# EAGLE design Puck (EAGLE 7.3.0)
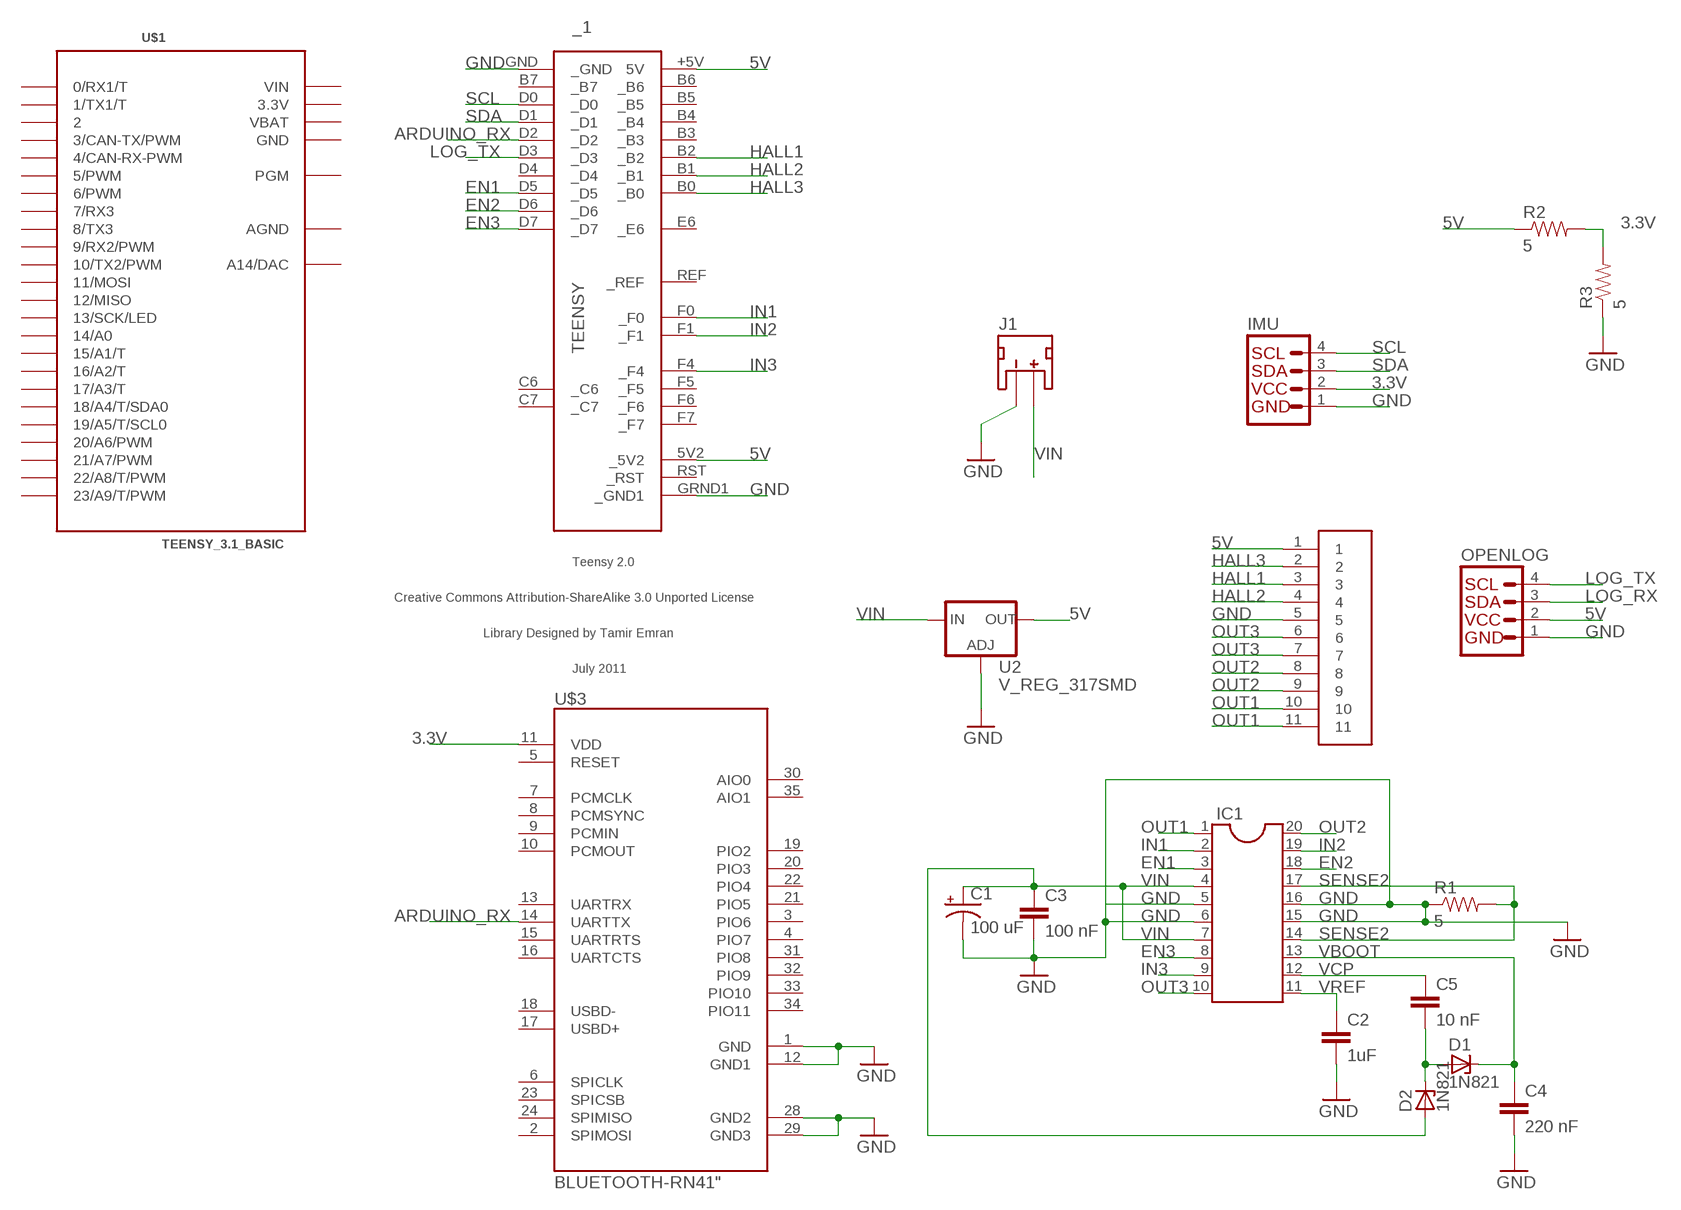
[diagram p0: schematic, sheet 1]

## Parts
_1  TEENSY  [TEENSY]
C1  100 uF  100UF-25V-20%(PTH)  [CPOL-RADIAL-100UF-25V]
C2  1uF  0.1UF-50V-20%(PTH)KIT-EZ  [CAP-PTH-SMALL-KIT]
C3  100 nF  0.1UF-50V-20%(PTH)KIT-EZ  [CAP-PTH-SMALL-KIT]
C4  220 nF  0.1UF-50V-20%(PTH)KIT-EZ  [CAP-PTH-SMALL-KIT]
C5  10 nF  0.1UF-50V-20%(PTH)KIT-EZ  [CAP-PTH-SMALL-KIT]
D1  1N821  [DO35Z10]
D2  1N821  [DO35Z10]
IC1  DIL20S  [SOCKET-20]
IMU  I2C_STANDARD  [1X04]
J1  JST_2MM_MALE  [JST-2-SMD]
MOLEX_MOTOR1  DEV  [52089FFCPACKAGE]
OPENLOG  I2C_STANDARD  [1X04]
R1  5  RESISTORAXIAL-0.3  [AXIAL-0.3]
R2  5  RESISTORAXIAL-0.3  [AXIAL-0.3]
R3  5  RESISTORAXIAL-0.3  [AXIAL-0.3]
U2  V_REG_317SMD  [SOT223]
U$1  TEENSY_3.1_BASIC  [TEENSY_3.1_BASIC]
U$3  BLUETOOTH-RN41"  [RN41]

## Nets
3.3V: IMU.2 R2.P$2 R3.P$2 U$3.11(VDD)
5V: _1.5V2(_5V2) _1.+5V(5V) MOLEX_MOTOR1.1 OPENLOG.2 R2.P$1 U2.2(OUT)
ARDUINO_RX: _1.D2(_D2) U$3.14(UARTTX)
EN1: _1.D5(_D5) IC1.3
EN2: _1.D6(_D6) IC1.18
EN3: _1.D7(_D7) IC1.8
GND [GND]: _1.GND(_GND) _1.GRND1(_GND1) C1.2(-) C2.2 C3.2 C4.2 IC1.5 IC1.6 IC1.15 IC1.16 IMU.1 J1.1(-) MOLEX_MOTOR1.5 OPENLOG.1 R1.P$1 R3.P$1 U2.1(ADJ) U$3.1(GND) U$3.12(GND1) U$3.28(GND2) U$3.29(GND3)
HALL1: _1.B2(_B2) MOLEX_MOTOR1.3
HALL2: _1.B1(_B1) MOLEX_MOTOR1.4
HALL3: _1.B0(_B0) MOLEX_MOTOR1.2
IN1: _1.F0(_F0) IC1.2
IN2: _1.F1(_F1) IC1.19
IN3: _1.F4(_F4) IC1.9
LOG_RX: OPENLOG.3
LOG_TX: _1.D3(_D3) OPENLOG.4
N$3: C5.2 D1.A D2.C
OUT1 [Power]: IC1.1 MOLEX_MOTOR1.10 MOLEX_MOTOR1.11
OUT2 [Power]: IC1.20 MOLEX_MOTOR1.8 MOLEX_MOTOR1.9
OUT3 [Power]: IC1.10 MOLEX_MOTOR1.6 MOLEX_MOTOR1.7
SCL: _1.D0(_D0) IMU.4
SDA: _1.D1(_D1) IMU.3
SENSE2: IC1.14 IC1.17 R1.P$2
VBOOT: C4.1 D1.C IC1.13
VCP: C5.1 IC1.12
VIN [Power]: C1.1(+) C3.1 D2.A IC1.4 IC1.7 J1.2(+) U2.3(IN)
VREF: C2.1 IC1.11
Unconnected: _1.B3(_B3) _1.B4(_B4) _1.B5(_B5) _1.B6(_B6) _1.B7(_B7) _1.C6(_C6) _1.C7(_C7) _1.D4(_D4) _1.E6(_E6) _1.F5(_F5) _1.F6(_F6) _1.F7(_F7) _1.REF(_REF) _1.RST(_RST) J1.NC1(PAD1) J1.NC2(PAD2) U$1.0(0/RX1/T) U$1.1(1/TX1/T) U$1.2 U$1.3(3/CAN-TX/PWM) U$1.4(4/CAN-RX-PWM) U$1.5(5/PWM) U$1.6(6/PWM) U$1.7(7/RX3) U$1.8(8/TX3) U$1.9(9/RX2/PWM) U$1.10(10/TX2/PWM) U$1.11(11/MOSI) U$1.12(12/MISO) U$1.13(13/SCK/LED) U$1.14/A0 U$1.15/A1(15/A1/T) U$1.16/A2(16/A2/T) U$1.17/A3(17/A3/T) U$1.18/A4(18/A4/T/SDA0) U$1.19/A5(19/A5/T/SCL0) U$1.20/A6(20/A6/PWM) U$1.21/A7(21/A7/PWM) U$1.22/A8(22/A8/T/PWM) U$1.23/A9(23/A9/T/PWM) U$1.A14(A14/DAC) U$1.PGM U$3.2(SPIMOSI) U$3.3(PIO6) U$3.4(PIO7) U$3.5(RESET) U$3.6(SPICLK) U$3.7(PCMCLK) U$3.8(PCMSYNC) U$3.9(PCMIN) U$3.10(PCMOUT) U$3.13(UARTRX) U$3.15(UARTRTS) U$3.16(UARTCTS) U$3.17(USBD+) U$3.18(USBD-) U$3.19(PIO2) U$3.20(PIO3) U$3.21(PIO5) U$3.22(PIO4) U$3.23(SPICSB) U$3.24(SPIMISO) U$3.30(AIO0) U$3.31(PIO8) U$3.32(PIO9) U$3.33(PIO10) U$3.34(PIO11) U$3.35(AIO1)

## Power pins joined to a net without a drawn wire
3.3V: U$1.3.3V U$1.3.3V1(3.3V)
AGND: U$1.AGND
GND: U$1.GND U$1.GND1(GND)
VBAT: U$1.VBAT
VIN: U$1.VIN

## Library data of the parts
_1 = teensy:TEENSY: Teensy 2.0 Original Design by Clint Fisher Modified Design by Tamir Emran Licensed Under Creative Commons Attribution-ShareAlike 3.0 Unported (CC BY-SA 3.0)
C1 = SparkFun-Capacitors:100UF-25V-20%(PTH): CAP-08439; PROD_ID: CAP-08439
C2-C5 = SparkFun-Capacitors:0.1UF-50V-20%(PTH): CAP-08370; PROD_ID: CAP-08370
D1 D2 = diode:1N821: Reference DIODE temperature compensated, 6,2 V
IC1 = ic-package:DIL20: Dual In Line / Socket
IMU OPENLOG = SparkFun-Connectors:I2C_STANDARD: SparkFun has standardized on a pinout for all I2C based sensor breakouts. This pinout allows I2C boards to be plugged directly into the headers on Arduino Uno compatible boards, and to be daisy chained easily.; MPN: BIM-AKT-Y1X-0.4M-RS4.21T/S561; OC_NEWARK: 31Y7236
J1 = SparkFun-Connectors:JST_2MM_MALE: Mates to single-cell LiPo batteries. CONN-08352; OC_NEWARK: unknown; PROD_ID: CONN-08352
MOLEX_MOTOR1 = Molex:DEV
R1-R3 = SparkFun-Passives:RESISTOR: Resistor Basic schematic elements and footprints for 0603, 1206, and PTH resistors.
U2 = SparkFun-PowerIC:V_REG_317: Voltage Regulator Standard LM317 adjustable voltage regulator. AOI (Adjust Output Input). Google 'LM317 Calculator' for easy to use app to get the two resistor values needed. 240/720 for 5V output. 240/390 for 3.3V output. Spark Fun Electronics SKU : COM-00527
U$1 = Teensy_3_Series_Board_v1.0:TEENSY_3.1_BASIC: Footprint for Teensy 3.1 board using all pin connections on the outer perimeter
U$3 = SparkFun-RF:BLUETOOTH-RN41: Bluetooth SMD module; OC_NEWARK: unknown

## Net classes
0 default: width 0.508 mm, drill 0.762 mm, clearance 0.254 mm
1 Power: width 0.813 mm, drill 1.016 mm, clearance 0.254 mm
2 GND: width 0.813 mm, drill 1.016 mm, clearance 0.254 mm

## Board
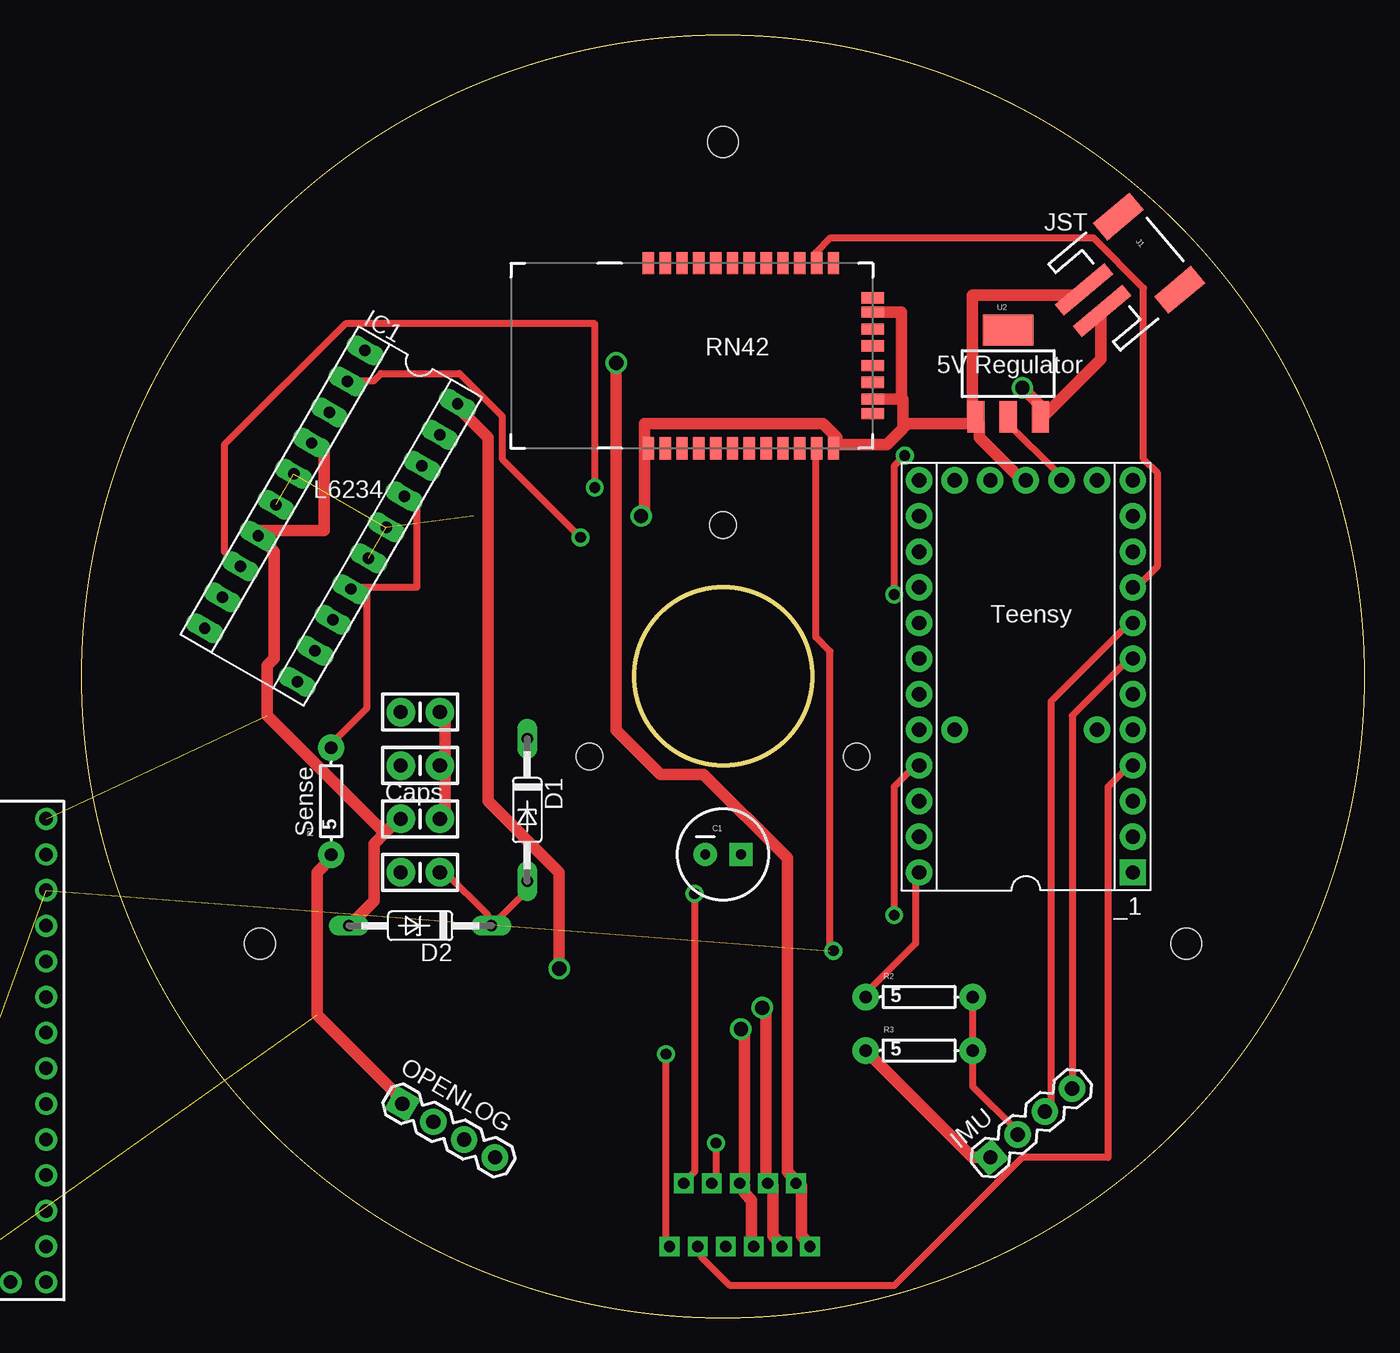
[diagram p1: board, top side]
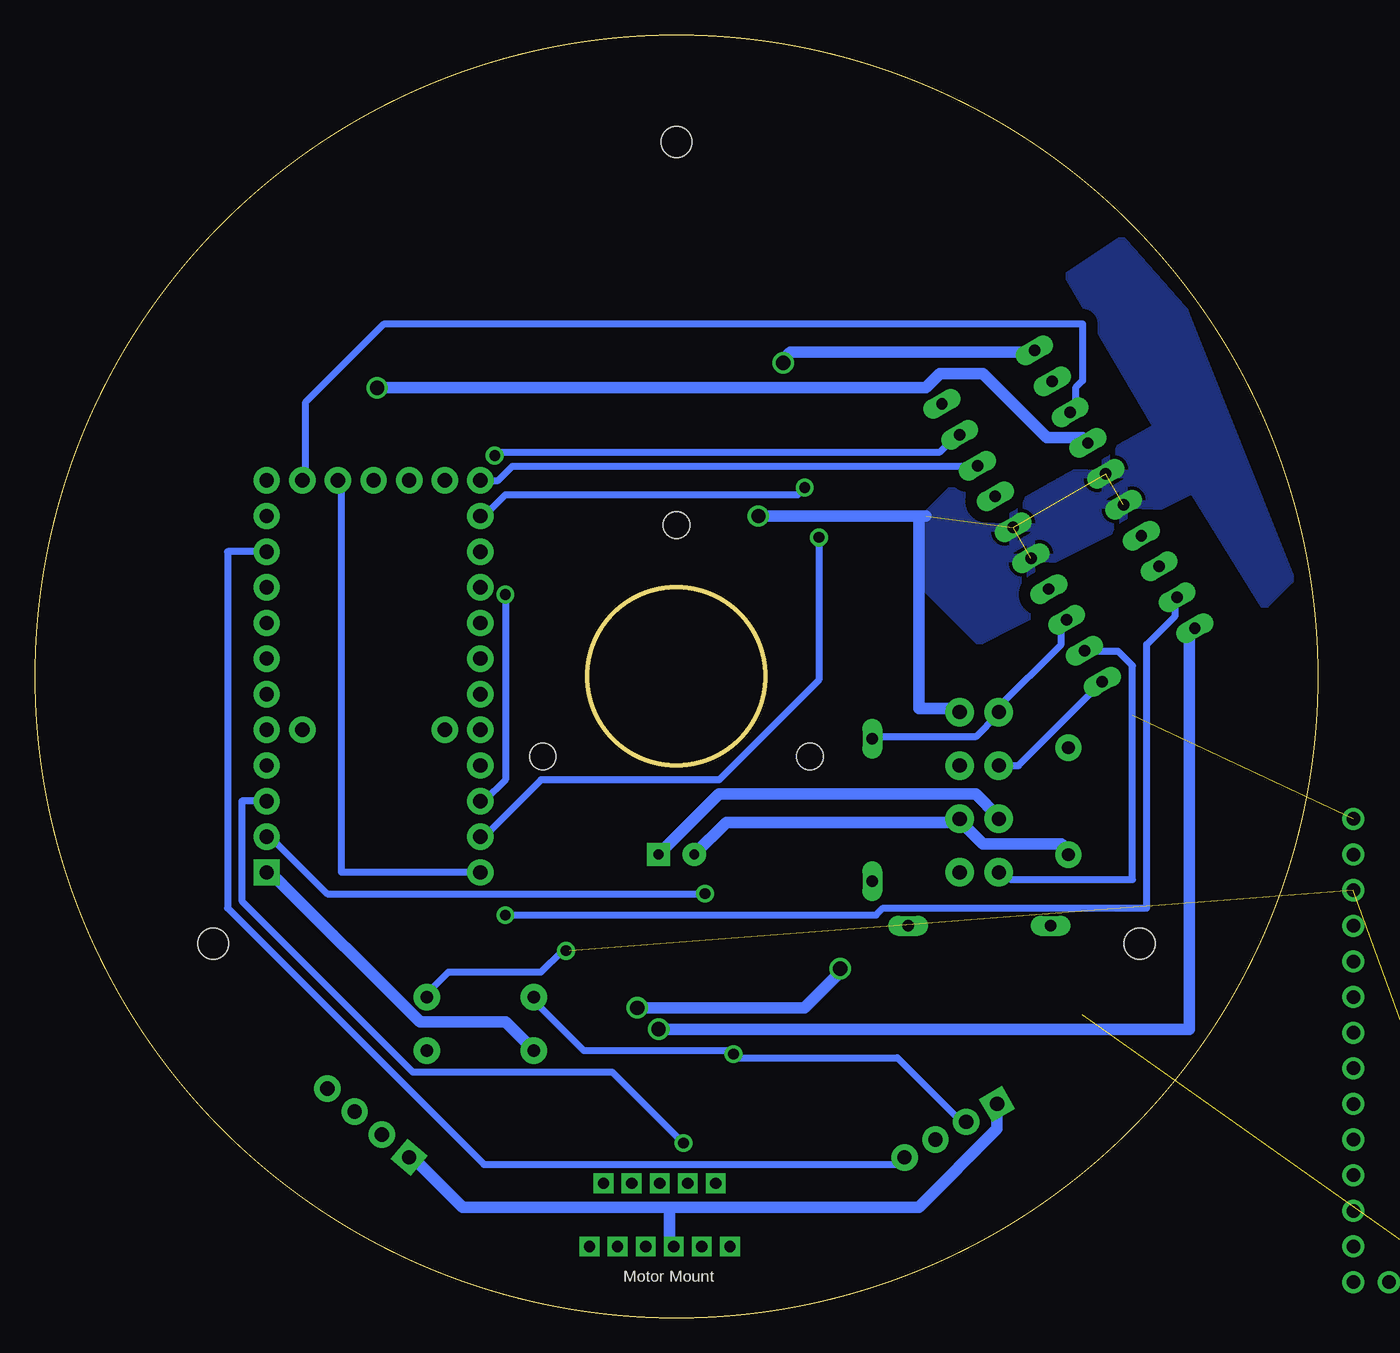
[diagram p2: board, bottom side, seen from below]

Size 91.44 x 91.44 mm. Coordinates in mm from the lower left corner, seen from the top.
Outline: circle at 45.72,45.72 radius 45.72
Outline: circle at 45.72,45.72 radius 6.35
Copper layers (1*16): Top 0.035mm / dielectric 1.5mm / Bottom 0.035mm
Design rules "SparkFun": minimum track width 8mil, minimum drill 20mil, track to track 8mil, track to pad 8mil, pad to pad 8mil, via to via 8mil, smd to smd 8mil, copper to edge 10mil, drill to drill 8mil, minimum pad ring 12mil, minimum via ring 10mil, stop-mask expansion 4mil, vias tented up to drill 25mil, thermal gap 10mil
Holes 2.2 mm at 45.72,83.82 12.7,26.67 78.74,26.67
Holes 1.88 mm at 55.24,40.01 45.72,56.52 36.2,40.01

### Footprints (pad centres in the part's own frame; a part is rotated, then mirrored left to right if it is on the bottom)
TEENSY = drill 1.016 pad 1.88: 5V2 13.97,-2.54; +5V -13.97,7.62; B0 -11.43,-7.62; B1 -8.89,-7.62; B2 -6.35,-7.62; B3 -3.81,-7.62; B4 8.89,7.62; B5 6.35,7.62; B6 3.81,7.62; B7 -1.27,-7.62; C6 11.43,-7.62; C7 13.97,-7.62; D0 1.27,-7.62; D1 3.81,-7.62; D2 6.35,-7.62; D3 8.89,-7.62; D4 13.97,5.08; D5 13.97,-5.08; D6 13.97,7.62; D7 11.43,7.62; E6 -3.81,-5.08; F0 -11.43,7.62; F1 -8.89,7.62; F4 -6.35,7.62; F5 -3.81,7.62; F6 -1.27,7.62; F7 1.27,7.62; GRND1 13.97,0; REF -3.81,5.08; RST 13.97,2.54 | drill 1.016 pad 1.88 square: GND -13.97,-7.62
CPOL-RADIAL-100UF-25V = drill 0.7 pad 1.651 square: 1 1.27,0 | drill 0.7 pad 1.651: 2 -1.27,0
CAP-PTH-SMALL-KIT = drill 1.016 pad 2.032: 1 -1.397,0; 2 1.397,0
DO35Z10 = drill 0.813 long: A 5.08,0; C -5.08,0
SOCKET-20 = drill 0.813 long: 1 -11.43,-3.81; 2 -8.89,-3.81; 3 -6.35,-3.81; 4 -3.81,-3.81; 5 -1.27,-3.81; 6 1.27,-3.81; 7 3.81,-3.81; 8 6.35,-3.81; 9 8.89,-3.81; 10 11.43,-3.81; 11 11.43,3.81; 12 8.89,3.81; 13 6.35,3.81; 14 3.81,3.81; 15 1.27,3.81; 16 -1.27,3.81; 17 -3.81,3.81; 18 -6.35,3.81; 19 -8.89,3.81; 20 -11.43,3.81
1X04 = drill 1.016 pad 1.88 square: 1 0,0 | drill 1.016 pad 1.88: 2 2.54,0; 3 5.08,0; 4 7.62,0
JST-2-SMD = smd 1 x 4.6: 1 -1,-3.7; 2 1,-3.7 | smd 1.6 x 3.4: NC1 -3.4,1.5; NC2 3.4,1.5
52089FFCPACKAGE = drill 0.8 square: 1 0,0; 2 1,4.5; 3 2,0; 4 3,4.5; 5 4,0; 6 5,4.5; 7 6,0; 8 7,4.5; 9 8,0; 10 9,4.5; 11 10,0
AXIAL-0.3 = drill 0.9 pad 1.88: P$1 -3.81,0; P$2 3.81,0
SOT223 = smd 1.219 x 2.235: 1 -2.311,-3.099; 2 0,-3.099; 3 2.311,-3.099 | smd 3.6 x 2.2: 4 0,3.099
TEENSY_3.1_BASIC = drill 0.965: 0 -7.62,13.97; 1 -7.62,11.43; 2 -7.62,8.89; 3 -7.62,6.35; 3.3V 7.62,11.43; 3.3V1 -2.54,-16.51; 4 -7.62,3.81; 5 -7.62,1.27; 6 -7.62,-1.27; 7 -7.62,-3.81; 8 -7.62,-6.35; 9 -7.62,-8.89; 10 -7.62,-11.43; 11 -7.62,-13.97; 12 -7.62,-16.51; 13 7.62,-16.51; 14/A0 7.62,-13.97; 15/A1 7.62,-11.43; 16/A2 7.62,-8.89; 17/A3 7.62,-6.35; 18/A4 7.62,-3.81; 19/A5 7.62,-1.27; 20/A6 7.62,1.27; 21/A7 7.62,3.81; 22/A8 7.62,6.35; 23/A9 7.62,8.89; A14 5.08,-16.51; AGND 7.62,13.97; GND -7.62,16.51; GND1 0,-16.51; PGM 2.54,-16.51; VBAT -5.08,-16.51; VIN 7.62,16.51
RN41 = smd 0.8 x 1.6: 1 -6.6,-6.6; 2 -5.4,-6.6; 3 -4.2,-6.6; 4 -3,-6.6; 5 -1.8,-6.6; 6 -0.6,-6.6; 7 0.6,-6.6; 8 1.8,-6.6; 9 3,-6.6; 10 4.2,-6.6; 11 5.4,-6.6; 12 6.6,-6.6; 13 6.6,6.6; 14 5.4,6.6; 15 4.2,6.6; 16 3,6.6; 17 1.8,6.6; 18 0.6,6.6; 19 -0.6,6.6; 20 -1.8,6.6; 21 -3,6.6; 22 -4.2,6.6; 23 -5.4,6.6; 24 -6.6,6.6 | smd 1.6 x 0.8: 28 9.4,3.1; 29 9.4,-3.1; 30 9.4,4.122; 31 9.4,1.9; 32 9.4,0.7; 33 9.4,-0.7; 34 9.4,-1.9; 35 9.4,-4.122

### Placement (x,y rotation side)
_1  67.31,45.72 90 top
C1  45.72,33.02 0 top
C2  24.13,39.37 0 top
C3  24.13,35.56 0 top
C4  24.13,43.18 0 top
C5  24.13,31.75 0 top
D1  31.75,36.2 270 top
D2  24.13,27.94 180 top
IC1  17.78,57.15 240 top
IMU  64.77,11.43 40 top
J1  74.93,74.93 310 top
MOLEX_MOTOR1  41.91,5.08 0 top
OPENLOG  22.86,15.24 330 top
R1  17.78,36.83 90 top
R2  59.69,22.86 0 top
R3  59.69,19.05 0 top
U2  66.04,67.31 0 top
U$1  -10.16,19.05 0 top
U$3  46.99,68.58 0 top

### Tracks (layer width: path | path; a pad name or v marks a point on that pad's centre or on a via)
3.3V  (via drill 0.76)  (2 unrouted)
  Top 0.508: U$3.11 52.32,61.72 52.32,48.51 53.34,47.5 53.34,26.16 v53.59,26.16 | R2.P$2 R3.P$2 63.5,16.51 66.55,13.46 IMU.2
  Bottom 0.508: v53.59,26.16 53.85,26.16 55.37,24.64 61.98,24.64 63.5,23.11 R2.P$2
5V  (via drill 0.76)
  Top 0.508: v41.66,18.8 41.66,5.33 MOLEX_MOTOR1.1 | U2.2 66.04,63.75 69.6,60.2 69.6,59.69 _1.5V2 | R2.P$1 55.88,23.11 59.44,26.67 59.44,31.75 _1.+5V
  Bottom 0.508: OPENLOG.2 25.4,13.97 29.97,18.54 41.66,18.54 v41.66,18.8 41.66,19.05 52.32,19.05 55.88,22.61 R2.P$1 | _1.+5V 69.6,31.75 69.6,59.69 _1.5V2
ARDUINO_RX
  Top 0.508: U$3.14 52.32,75.44 52.32,75.95 53.34,76.96 72.14,76.96 75.69,73.41 75.69,61.21 76.71,60.2 76.71,53.59 75.18,52.07 _1.D2
EN1
  Bottom 0.508: IC1.3 17.27,64.77 17.27,66.29 16.76,66.8 16.76,70.87 66.55,70.87 72.14,65.28 72.14,59.69 _1.D5
EN2
  Bottom 0.508: _1.D6 58.42,59.69 57.4,60.71 24.38,60.71 IC1.18
EN3  (via drill 0.76)
  Top 0.508: v36.58,59.18 36.58,70.87 18.8,70.87 10.16,62.23 10.16,54.61 11.18,53.59 IC1.8
  Bottom 0.508: v36.58,59.18 37.08,58.67 57.91,58.67 59.44,57.15 _1.D7
GND  (via drill 1.02)  (6 unrouted)
  Top 0.813: R3.P$1 63.5,11.43 IMU.1 | 53.85,62.23 57.4,62.23 58.55,63.37 | 58.55,63.37 58.93,63.75 63.5,63.75 U2.1 | _1.GRND1 67.06,59.69 64.01,62.74 64.01,63.75 U2.1 | J1.1 71.12,72.9 63.5,72.9 63.5,64.26 U2.1 | v39.88,57.15 40.13,57.15 40.13,61.72 U$3.1 40.13,62.23 40.13,63.75 52.83,63.75 53.85,62.74 53.85,62.23 | 25.91,39.37 25.91,42.93 C4.2 | OPENLOG.1 22.86,15.49 16.76,21.59 16.76,31.75 17.78,32.77 R1.P$1 | 25.91,39.37 25.91,35.81 C3.2 | 25.91,39.37 C2.2 | 53.85,62.23 U$3.12 | U$3.29 58.42,65.48 | 58.42,65.48 58.55,65.48 58.55,63.37 | U$3.28 58.42,71.68 58.42,65.48
  Bottom 0.813: 46.23,7.87 46.23,5.33 MOLEX_MOTOR1.5 | 46.23,7.87 60.96,7.87 64.52,11.43 IMU.1 | R3.P$1 57.91,21.08 64.01,21.08 74.68,31.75 _1.GND | 27.94,57.15 28.45,57.15 | 28.45,57.15 v39.88,57.15 | C1.2 42.16,35.31 25.91,35.31 C3.2 25.4,35.31 23.88,33.78 18.29,33.78 17.78,33.27 R1.P$1 | 28.45,57.15 28.45,43.43 25.91,43.43 C4.2 | 46.23,7.87 28.45,7.87 22.86,13.46 OPENLOG.1
  pour Bottom (isolate 0.813, rank 5): 11.43,63.5 21.59,57.79 24.13,60.96 27.94,57.15 27.94,52.07 24.13,48.26 19.05,50.8 20.32,53.34 8.89,59.05 3.81,50.8 1.91,52.71 9.53,71.75 13.97,76.84 17.78,74.3
HALL1
  Top 0.508: MOLEX_MOTOR1.3 44.2,4.83 44.2,4.32 46.23,2.29 57.91,2.29 67.06,11.43 73.15,11.43 73.15,37.85 74.68,39.37 _1.B2
HALL2  (via drill 0.76)
  Top 0.508: v45.21,12.45 45.21,9.91 MOLEX_MOTOR1.4
  Bottom 0.508: v45.21,12.45 50.29,17.53 64.52,17.53 76.71,29.72 76.71,36.83 _1.B1
HALL3  (via drill 0.76)
  Top 0.508: v43.69,30.23 43.69,10.41 43.18,9.91 MOLEX_MOTOR1.2
  Bottom 0.508: v43.69,30.23 70.61,30.23 74.68,34.29 _1.B0
IN1  (via drill 0.76)
  Top 0.508: v35.56,55.63 29.97,61.21 29.97,64.26 26.92,67.31 21.34,67.31 20.83,66.8 19.3,66.8 IC1.2
  Bottom 0.508: v35.56,55.63 35.56,45.47 42.67,38.35 55.37,38.35 59.44,34.29 _1.F0
IN2  (via drill 0.76)
  Top 0.508: v57.91,51.56 57.91,60.71 v58.67,61.47
  Bottom 0.508: IC1.19 25.91,62.74 26.92,61.72 58.42,61.72 v58.67,61.47 | v57.91,51.56 57.91,38.35 59.44,36.83 _1.F1
IN3  (via drill 0.76)
  Top 0.508: v57.91,28.7 57.91,37.85 59.44,39.37 _1.F4
  Bottom 0.508: v57.91,28.7 31.5,28.7 30.99,29.21 12.19,29.21 12.19,48.01 10.16,50.04 10.16,51.05 IC1.9
LOG_TX
  Bottom 0.508: _1.D3 77.72,54.61 77.72,29.21 59.44,10.92 29.97,10.92 OPENLOG.4
N$3
  Top 0.508: D1.A 31.5,30.73 31.5,30.23 D2.C 28.96,28.19 28.96,28.7 25.91,31.75 C5.2
OUT1  (via drill 1.02)
  Top 0.813: MOLEX_MOTOR1.11 51.82,5.33 51.31,5.84 51.31,9.4 MOLEX_MOTOR1.10 50.8,9.91 50.29,10.41 50.29,32.77 44.32,38.73 41.27,38.73 38.1,41.91 v38.1,68.07
  Bottom 0.813: v38.1,68.07 38.1,68.33 37.59,68.83 20.32,68.83 IC1.1
OUT2  (via drill 1.02)
  Top 0.813: MOLEX_MOTOR1.9 49.78,5.33 49.28,5.84 49.28,9.4 MOLEX_MOTOR1.8 48.77,9.91 48.77,22.1 v48.51,22.1 | v34.04,24.89 34.04,31.75 28.96,36.83 28.96,62.74 26.92,64.77 IC1.20
  Bottom 0.813: v48.51,22.1 36.58,22.1 34.04,24.64 v34.04,24.89
OUT3  (via drill 1.02)
  Top 0.813: v46.99,20.57 47.24,20.57 47.24,9.91 MOLEX_MOTOR1.6 47.24,9.4 47.24,8.89 47.75,8.38 47.75,5.33 MOLEX_MOTOR1.7
  Bottom 0.813: v46.99,20.57 9.14,20.57 9.14,49.02 IC1.10
SCL
  Top 0.508: IMU.4 70.61,16.51 70.61,42.93 74.68,46.99 _1.D0
SDA
  Top 0.508: IMU.3 69.09,14.99 69.09,43.94 74.68,49.53 _1.D1
SENSE2
  Top 0.508: 20.32,52.07 23.88,52.07 23.88,57.66 23.37,58.17 IC1.17 | 20.32,52.07 19.3,52.07 IC1.14 20.32,52.07 | 20.32,52.07 20.32,43.43 17.78,40.89 R1.P$2
VBOOT
  Bottom 0.508: IC1.13 18.29,49.53 18.29,48.01 22.86,43.43 C4.1 22.86,42.93 24.38,41.4 31.5,41.4 D1.C
VCP
  Bottom 0.508: IC1.12 16.26,47.5 14.22,47.5 13.21,46.48 13.21,31.24 21.84,31.24 22.35,31.75 C5.1
VIN  (via drill 1.02)  (1 unrouted)
  Top 0.813: J1.2 72.64,71.37 72.64,68.33 68.58,64.26 U2.3 68.58,64.77 v67.06,66.29 | IC1.4 16.76,62.23 17.27,61.72 17.27,56.13 12.7,56.13 IC1.7 12.7,55.63 13.72,54.61 13.72,46.99 13.21,46.48 13.21,42.93 21.59,34.54 | D2.A 20.83,29.72 20.83,33.78 21.59,34.54 | 21.59,34.54 22.35,35.31 C3.1
  Bottom 0.813: C1.1 42.67,37.34 24.38,37.34 22.86,35.81 C3.1 | v67.06,66.29 27.94,66.29 26.92,67.31 23.88,67.31 19.3,62.74 16.76,62.74 IC1.4
VREF
  Bottom 0.508: C2.1 21.34,39.37 15.75,44.96 IC1.11

### Text on the board
tNames: JST | RN42 | 5V Regulator | L6234 | Teensy | Caps | Sense
bNames: Motor Mount